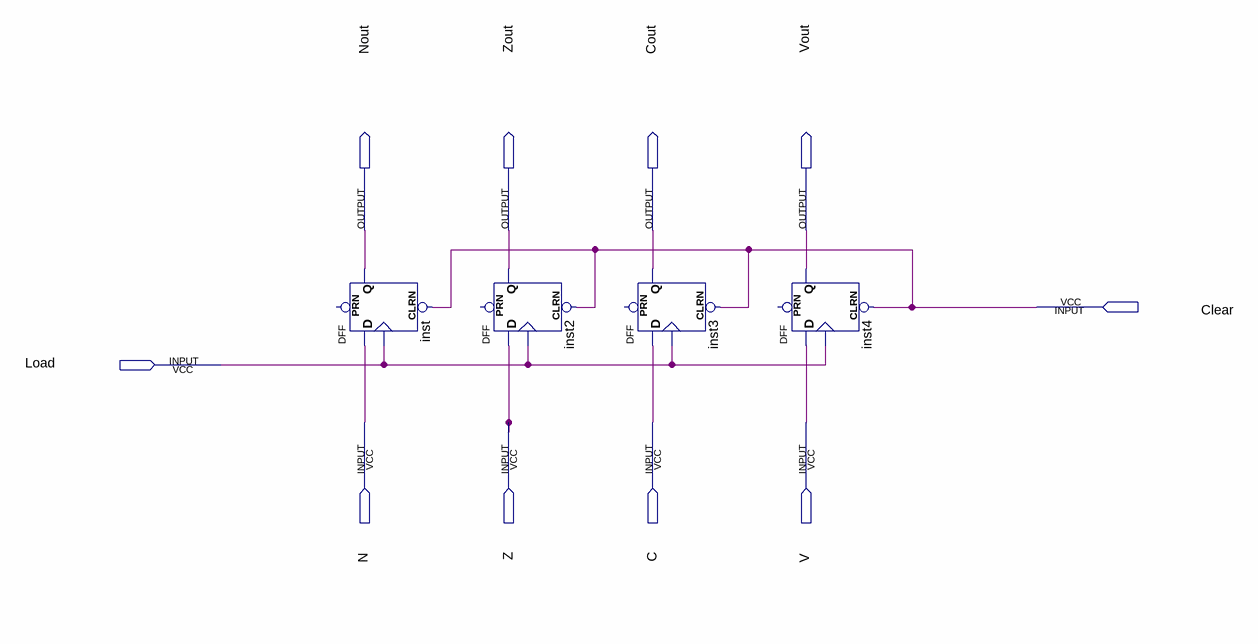
[diagram p0: schematic sheet]
// Quartus schematic FlagRegister.bdf as structural Verilog: 4 symbols, 10 pins
module FlagRegister (
  input  Clear,
  input  Load,
  input  N,
  input  Z,
  input  C,
  input  V,
  output Nout,
  output Zout,
  output Cout,
  output Vout
);

  DFF inst (.CLRN(Clear), .CLK(Load), .D(N), .Q(Nout));  // open: PRN
  DFF inst2 (.CLRN(Clear), .CLK(Load), .D(Z), .Q(Zout));  // open: PRN
  DFF inst3 (.CLRN(Clear), .CLK(Load), .D(C), .Q(Cout));  // open: PRN
  DFF inst4 (.CLRN(Clear), .CLK(Load), .D(V), .Q(Vout));  // open: PRN
endmodule
